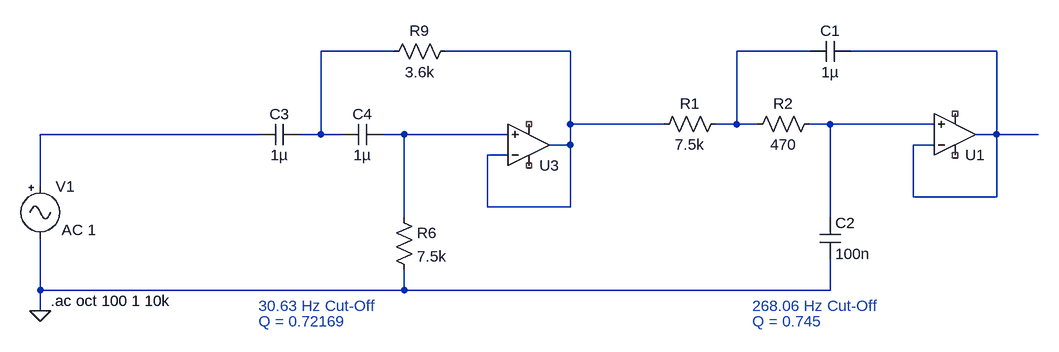
[diagram p0: schematic AnalogFilterHeart.asc]
AnalogFilterHeart.asc, the LTspice schematic file:
Version 4
SHEET 1 2100 680
WIRE 1104 -48 992 -48
WIRE 1376 -48 1184 -48
WIRE 1744 -48 1632 -48
WIRE 2032 -48 1808 -48
WIRE 1376 64 1376 -48
WIRE 1520 64 1376 64
WIRE 1632 64 1632 -48
WIRE 1632 64 1600 64
WIRE 1664 64 1632 64
WIRE 1776 64 1744 64
WIRE 1936 64 1776 64
WIRE 896 80 560 80
WIRE 992 80 992 -48
WIRE 992 80 960 80
WIRE 1024 80 992 80
WIRE 1120 80 1088 80
WIRE 1280 80 1120 80
WIRE 2032 80 2032 -48
WIRE 2032 80 2000 80
WIRE 2096 80 2032 80
WIRE 1376 96 1376 64
WIRE 1376 96 1344 96
WIRE 1936 96 1904 96
WIRE 1280 112 1248 112
WIRE 560 160 560 80
WIRE 1904 176 1904 96
WIRE 2032 176 2032 80
WIRE 2032 176 1904 176
WIRE 1248 192 1248 112
WIRE 1376 192 1376 96
WIRE 1376 192 1248 192
WIRE 1120 208 1120 80
WIRE 1776 208 1776 64
WIRE 560 320 560 240
WIRE 1120 320 1120 288
WIRE 1120 320 560 320
WIRE 1776 320 1776 272
WIRE 1776 320 1120 320
WIRE 560 352 560 320
FLAG 560 352 0
SYMBOL Misc\\signal 560 144 R0
WINDOW 123 33 83 Left 2
WINDOW 39 0 0 Left 0
SYMATTR Value2 AC 1
SYMATTR InstName V1
SYMATTR Value ""
SYMBOL res 1504 80 R270
WINDOW 0 32 56 VTop 2
WINDOW 3 0 56 VBottom 2
SYMATTR InstName R1
SYMATTR Value 7.5k
SYMBOL res 1648 80 R270
WINDOW 0 32 56 VTop 2
WINDOW 3 0 56 VBottom 2
SYMATTR InstName R2
SYMATTR Value 470
SYMBOL cap 1744 -32 R270
WINDOW 0 32 32 VTop 2
WINDOW 3 0 32 VBottom 2
SYMATTR InstName C1
SYMATTR Value 1µ
SYMBOL cap 1760 208 R0
SYMATTR InstName C2
SYMATTR Value 100n
SYMBOL OpAmps\\UniversalOpAmp 1968 80 M180
SYMATTR InstName U1
SYMBOL cap 960 64 R90
WINDOW 0 0 32 VBottom 2
WINDOW 3 32 32 VTop 2
SYMATTR InstName C3
SYMATTR Value 1µ
SYMBOL cap 1088 64 R90
WINDOW 0 0 32 VBottom 2
WINDOW 3 32 32 VTop 2
SYMATTR InstName C4
SYMATTR Value 1µ
SYMBOL res 1104 192 R0
SYMATTR InstName R6
SYMATTR Value 7.5k
SYMBOL OpAmps\\UniversalOpAmp 1312 96 M180
SYMATTR InstName U3
SYMBOL res 1088 -32 R270
WINDOW 0 32 56 VTop 2
WINDOW 3 0 56 VBottom 2
SYMATTR InstName R9
SYMATTR Value 3.6k
TEXT 576 336 Left 2 !.ac oct 100 1 10k
TEXT 1656 344 Left 2 ;268.06 Hz Cut-Off
TEXT 896 344 Left 2 ;30.63 Hz Cut-Off
TEXT 1656 368 Left 2 ;Q = 0.745
TEXT 896 368 Left 2 ;Q = 0.72169

The netlist it stands for:
* AnalogFilterHeart.asc
V1 N006 0 AC 1
R1 N002 N003 7.5k
R2 N003 N005 470
C1 N003 N004 1µ
C2 N005 0 100n
XU1 N005 N004 NC_01 NC_02 N004 level1 Avol=1Meg GBW=10Meg Vos=0 En=0 Enk=0 In=0 Ink=0 Rin=500Meg  ; pins In+ In- V+ V- OUT
C3 N001 N006 1µ
C4 N007 N001 1µ
R6 N007 0 7.5k
XU3 N007 N002 NC_03 NC_04 N002 level1 Avol=1Meg GBW=10Meg Vos=0 En=0 Enk=0 In=0 Ink=0 Rin=500Meg  ; pins In+ In- V+ V- OUT
R9 N001 N002 3.6k
.ac oct 100 1 10k
* 268.06 Hz Cut-Off
* 30.63 Hz Cut-Off
* Q = 0.745
* Q = 0.72169
.lib UniversalOpAmp1.lib
.backanno
.end